# EAGLE design Portals_Controls (EAGLE 9.6.2)
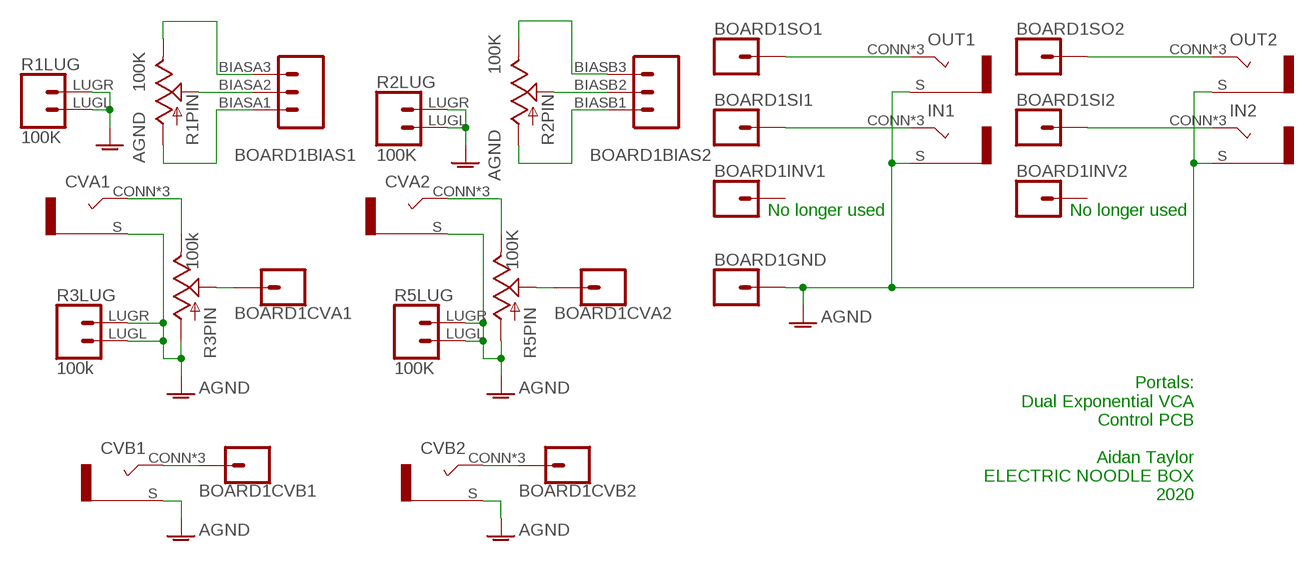
[diagram p0: schematic, sheet 1]

## Parts
BOARD1  PORTALS_LINK  [PORTALS]
CVA1  COMBI-JACKCINCHNANA  [NEWCOMBOJACK_PANEL]
CVA2  COMBI-JACKCINCHNANA  [NEWCOMBOJACK_PANEL]
CVB1  COMBI-JACKCINCHNANA  [NEWCOMBOJACK_PANEL]
CVB2  COMBI-JACKCINCHNANA  [NEWCOMBOJACK_PANEL]
IN1  COMBI-JACKCINCHNANA  [NEWCOMBOJACK_PANEL]
IN2  COMBI-JACKCINCHNANA  [NEWCOMBOJACK_PANEL]
OUT1  COMBI-JACKCINCHNANA  [NEWCOMBOJACK_PANEL]
OUT2  COMBI-JACKCINCHNANA  [NEWCOMBOJACK_PANEL]
R1  100K  POTENTIOMETER  [ALPHA_RV09_9MMPOT]
R2  100K  POTENTIOMETER  [ALPHA_RV09_9MMPOT]
R3  100k  POTENTIOMETER  [ALPHA_RV09_9MMPOT]
R5  100K  POTENTIOMETER  [ALPHA_RV09_9MMPOT]

## Nets
AGND: BOARD1.G1 BOARD1.G2 BOARD1.G3 BOARD1.G4 CVA1.S CVA2.S CVB1.S CVB2.S IN1.S IN2.S OUT1.S OUT2.S R1.LUGL R1.LUGR R2.LUGL R2.LUGR R3.C1(PIN:A) R3.LUGL R3.LUGR R5.C1(PIN:A) R5.LUGL R5.LUGR
N$1: BOARD1.CVA2 CVB1.CONN(T) CVB1.T1(T) CVB1.T2(T)
N$2: BOARD1.CVIB2 CVB2.CONN(T) CVB2.T1(T) CVB2.T2(T)
N$3: CVA1.CONN(T) CVA1.T1(T) CVA1.T2(T) R3.C3(PIN:B)
N$4: BOARD1.CVA1 R3.C2(PIN:W)
N$5: BOARD1.BIASA2 R1.C2(PIN:W)
N$6: BOARD1.BIASA1 R1.C1(PIN:A)
N$7: BOARD1.BIASA3 R1.C3(PIN:B)
N$8: BOARD1.SOA OUT1.CONN(T) OUT1.T1(T) OUT1.T2(T)
N$9: BOARD1.SIA IN1.CONN(T) IN1.T1(T) IN1.T2(T)
N$10: BOARD1.SIB IN2.CONN(T) IN2.T1(T) IN2.T2(T)
N$11: CVA2.CONN(T) CVA2.T1(T) CVA2.T2(T) R5.C3(PIN:B)
N$14: BOARD1.CVIB1 R5.C2(PIN:W)
N$15: BOARD1.BIASB1 R2.C1(PIN:A)
N$16: BOARD1.BIASB2 R2.C2(PIN:W)
N$17: BOARD1.BIASB3 R2.C3(PIN:B)
N$19: BOARD1.SOB OUT2.CONN(T) OUT2.T1(T) OUT2.T2(T)
Unconnected: BOARD1.INVA BOARD1.INVB

## Notes on the sheet
- No longer used | No longer used
- Portals:
  Dual Exponential VCA
  Control PCB
  
  Aidan Taylor
  ELECTRIC NOODLE BOX
  2020

## Library data of the parts
BOARD1 = ElectricNoodleBox:PORTALS_LINK
CVA1 CVA2 CVB1 CVB2 IN1 IN2 OUT1 OUT2 = ElectricNoodleBox:COMBI-JACK
R1-R3 R5 = ElectricNoodleBox:POTENTIOMETER

## Board
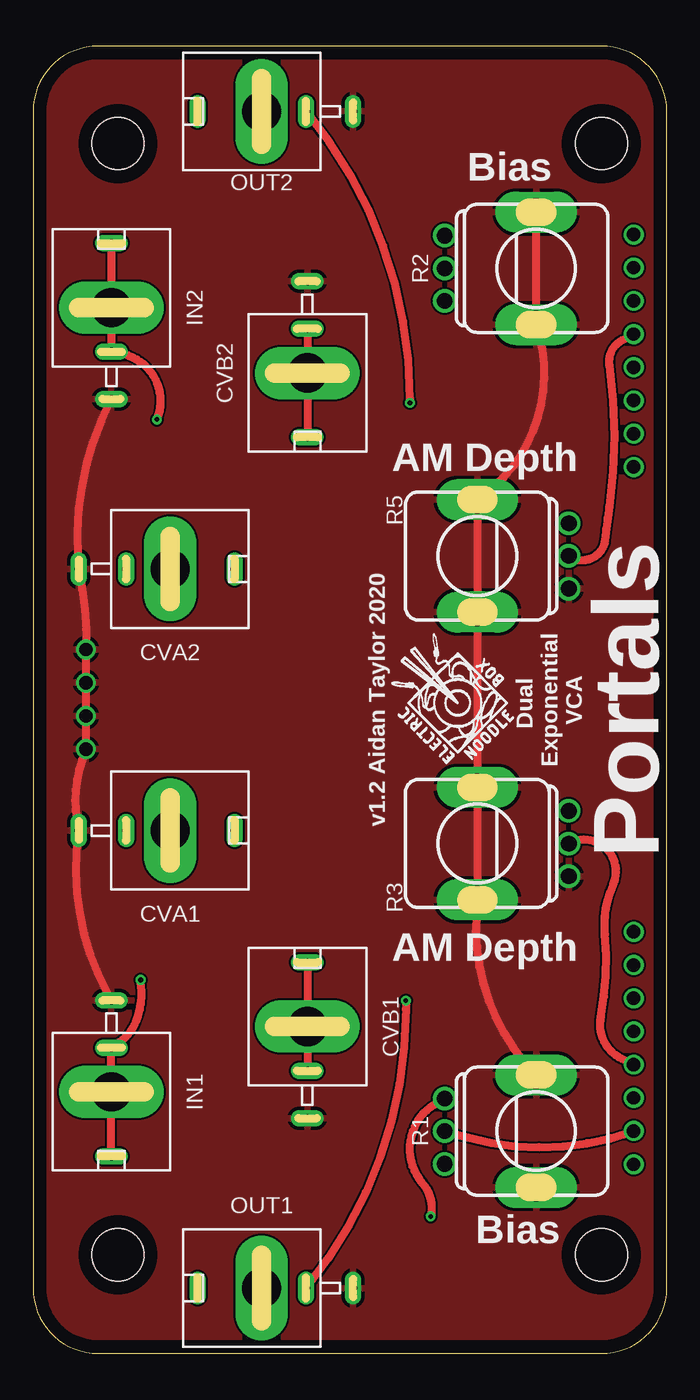
[diagram p1: board, top side]
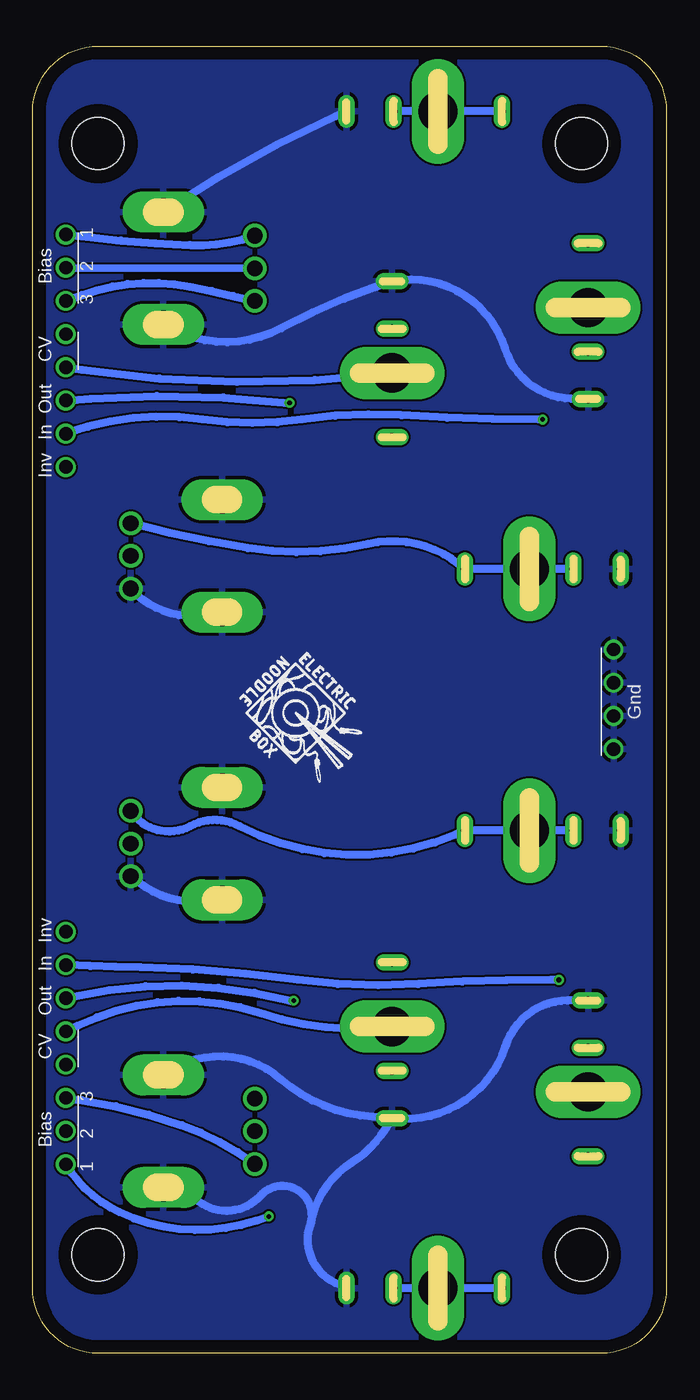
[diagram p2: board, bottom side, seen from below]

Size 48.5 x 100 mm. Coordinates in mm from the lower left corner, seen from the top.
Outline: 43.5,100 5,100 arc90 0,95 0,5 arc90 5,0 43.5,0 arc90 48.5,5 48.5,95 arc90 43.5,100
Copper layers (1*16): Top 0.035mm / dielectric 1.5mm / Bottom 0.035mm
Design rules "default": minimum track width 6mil, minimum drill 0.35mm, track to track 6mil, track to pad 6mil, pad to pad 6mil, via to via 6mil, smd to smd 6mil, copper to edge 40mil, drill to drill 6mil, minimum pad ring 10mil, minimum via ring 8mil, stop-mask expansion 4mil, vias tented up to drill 0mil, thermal gap 10mil

### Footprints (pad centres in the part's own frame; a part is rotated, then mirrored left to right if it is on the bottom)
PORTALS = drill 1.016: BIASA1 2.54,11.93; BIASA2 2.54,14.47; BIASA3 2.54,17.01; BIASB1 2.54,83.05; BIASB2 2.54,80.51; BIASB3 2.54,77.97; CVA1 2.54,19.55; CVA2 2.54,22.09; CVIB1 2.54,75.43; CVIB2 2.54,72.89; G1 44.45,43.68; G2 44.45,46.22; G3 44.45,48.76; G4 44.45,51.3; INVA 2.54,29.71; INVB 2.54,65.27; SIA 2.54,27.17; SIB 2.54,67.81; SOA 2.54,24.63; SOB 2.54,70.35 | hole 4: 5,5; 5,90; 42,5; 42,90
NEWCOMBOJACK_PANEL = drill 3 pad 3.6 long: CONN 0,0 | drill 0.6 pad 1.27 long: S 0,-7; T1 0,4.92; T2 0,-3.38
ALPHA_RV09_9MMPOT = drill 1.2 pad 1.778: C1 -2.5,-7; C2 0,-7; C3 2.5,-7 | drill 2.1 pad 2.8 long: LUGL -4.3,0; LUGR 4.3,0

### Placement (x,y rotation side)
BOARD1  48.5,2.54 0 bottom
CVA1  10.5,40 270 top
CVA2  10.5,60 270 top
CVB1  21,25 0 top
CVB2  21,75 180 top
IN1  6,20 180 top
IN2  6,80 0 top
OUT1  17.5,5 90 top
OUT2  17.5,95 90 top
R1  38.5,17 270 top
R2  38.5,83 270 top
R3  34,39 90 top
R5  34,61 90 top
U$1  [LOGO10X10]  37.1,45.09 90 top
U$2  [LOGO10X10]  32.97,53.66 270 bottom

### Tracks (layer width: path | path; a pad name or v marks a point on that pad's centre or on a via)
AGND
  Top 0.61: R2.LUGL R2.LUGR arc-72 34.56,65.72 R5.LUGR R5.LUGL R3.LUGR R3.LUGL 33.92,33.66 arc49 R1.LUGL | IN2.S arc31 3.45,60.96 CVA2.S 3.76,58.42 arc-12 BOARD1.G4 BOARD1.G3 BOARD1.G2 BOARD1.G1 3.76,45.4 arc33 CVA1.S arc36 5.67,27.62 IN1.S
  Bottom 0.61: OUT2.S 25.35,94.61 arc-10 R2.LUGL | R2.LUGR arc-60 29.48,78.42 arc9 22.18,81.6 CVB2.S arc84 12.34,76.83 arc-71 7.26,73.03 IN2.S | R5.LUGL 34.88,56.52 arc60 R5.C1 | R3.LUGL 34.56,34.61 arc52 R3.C1 | OUT1.S 25.35,5.4 arc84 27.26,9.84 | 27.26,9.84 arc-157 31.07,12.06 arc80 35.51,11.43 arc-18 R1.LUGR | CVB1.S 21.54,17.14 arc25 24.08,14.61 arc-48 27.26,9.84 | CVB1.S 22.5,18.1 arc37 29.48,20.95 arc-77 R1.LUGL | IN1.S 7.57,26.99 arc-72 12.34,23.5 arc79 CVB1.S
  pour Top: 0,0 49,0 49,100 0,100
  pour Bottom: 0,0 49,0 49,100 0,100
N$1
  Top 0.61: CVB1.T1 CVB1.CONN CVB1.T2
  Bottom 0.61: BOARD1.CVA2 45.04,25.08 arc44 31.07,26.04 arc-25 CVB1.CONN
N$2
  Top 0.61: CVB2.T2 CVB2.CONN CVB2.T1
  Bottom 0.61: BOARD1.CVIB2 44.72,75.25 arc-16 CVB2.CONN
N$3
  Bottom 0.61: CVA1.T2 CVA1.CONN CVA1.T1 16.14,39.69 arc51 32.66,40.32 arc-55 36.47,40.32 arc85 R3.C3
N$4
  Top 0.61: BOARD1.CVA1 45.04,22.54 arc-75 43.45,25.72 arc16 43.77,32.07 arc-29 44.4,35.88 arc143 R3.C2
N$5
  Top 0.61: R1.C2 33.29,16.51 arc35 BOARD1.BIASA2
N$6  (via drill 0.35)
  Top 0.61: R1.C1 30.75,19.05 arc100 29.8,13.02 arc-54 v30.43,10.48
  Bottom 0.61: v30.43,10.48 31.38,10.16 arc44 41.86,10.79 arc33 BOARD1.BIASA1
N$7
  Bottom 0.61: BOARD1.BIASA3 44.72,19.37 arc11 37.1,17.46 arc16 R1.C3
N$8  (via drill 0.35)
  Top 0.61: v28.53,26.99 28.53,26.35 arc-39 OUT1.T2
  Bottom 0.61: BOARD1.SOA 45.35,27.3 arc27 28.84,26.99 arc-30 v28.53,26.99 | OUT1.T1 OUT1.CONN OUT1.T2
N$9  (via drill 0.35)
  Top 0.61: IN1.T1 IN1.CONN IN1.T2 6.62,23.81 arc33 7.89,25.4 arc33 8.21,28.57 arc-213 v8.24,28.57
  Bottom 0.61: v8.24,28.57 8.84,28.57 arc-4 19,28.26 arc12 28.21,28.57 arc-7 40.27,29.53 arc1 BOARD1.SIA
N$10  (via drill 0.35)
  Top 0.61: IN2.T1 IN2.CONN IN2.T2 6.62,76.52 arc-103 v9.48,71.44
  Bottom 0.61: v9.48,71.44 9.79,71.44 arc3 20.27,71.75 arc-12 27.89,71.44 arc16 35.51,71.44 arc-28 BOARD1.SIB
N$11
  Bottom 0.61: CVA2.T2 CVA2.CONN CVA2.T1 15.83,60.33 arc-52 22.81,61.91 arc22 32.02,61.59 arc6 R5.C3
N$14
  Top 0.61: BOARD1.CVIB1 45.04,77.47 arc70 44.09,75.56 arc-17 44.09,64.77 arc3 43.77,62.23 arc-120 R5.C2
N$15
  Bottom 0.61: BOARD1.BIASB1 44.4,85.41 arc-4 36.47,84.77 arc-22 R2.C1
N$16
  Bottom 0.61: BOARD1.BIASB2 R2.C2
N$17
  Bottom 0.61: BOARD1.BIASB3 44.72,80.96 arc31 36.47,81.6 arc2 R2.C3
N$19  (via drill 0.35)
  Top 0.61: v28.84,72.71 28.84,73.03 arc40 OUT2.T2
  Bottom 0.61: BOARD1.SOB 44.09,73.03 arc11 v28.84,72.71 | OUT2.T1 OUT2.CONN OUT2.T2

### Text on the board
tPlace: Bias | AM Depth | v1.2 Aidan Taylor 2020 | Dual / Exponential / VCA | Portals | AM Depth | Bias